# EasyEDA schematic GVM Battery Light.json
TITLE: Sheet_1; REV: 1.0; Date: 2026-01-06; Sheet: 1/1; Company: Your Company
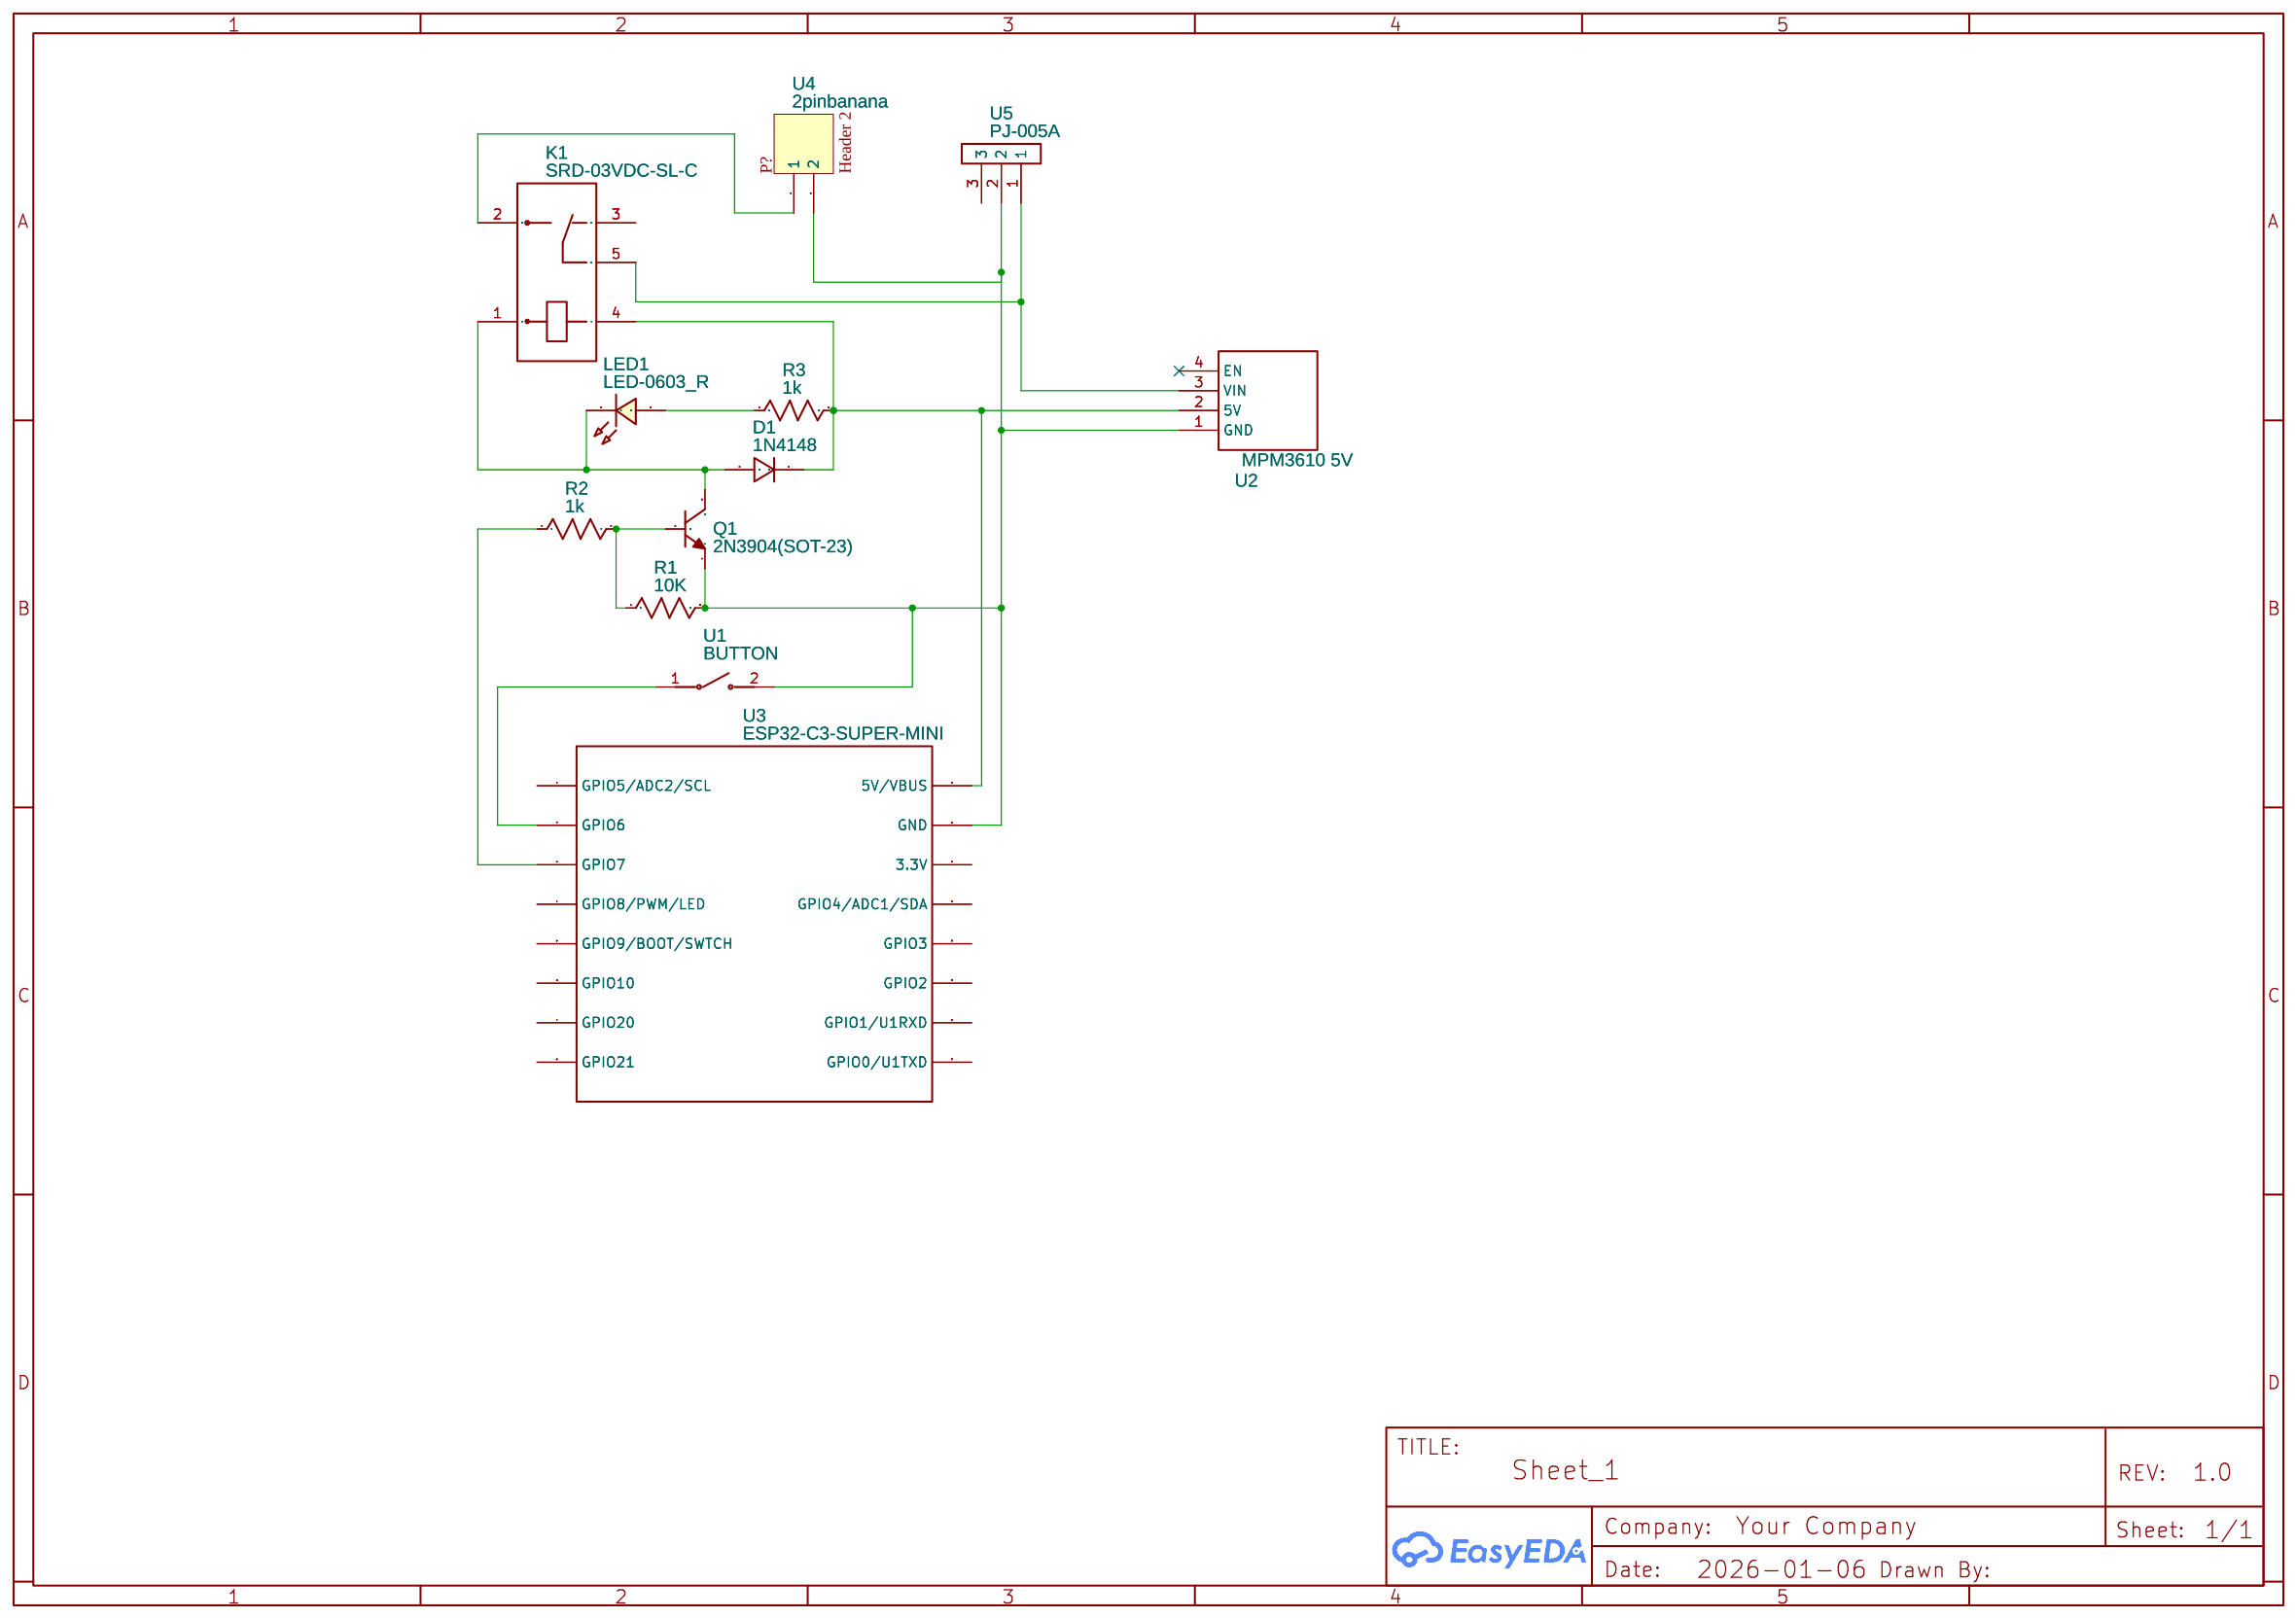
[diagram p0: schematic sheet]

## Parts
D1  1N4148  [DO-35_BD2.0-L4.2-P8.20-D0.5-RD]
K1  SRD-03VDC-SL-C  [RELAY-TH_SRD-XXVDC-XL-C]
LED1  LED-0603_R  [LED0603_RED]
Q1  2N3904(SOT-23)  [SOT-23-3_L2.9-W1.3-P1.90-LS2.4-TR]
R1  10K  [R_AXIAL-0.3]
R2  1k  [R_AXIAL-0.3]
R3  1k  [R_AXIAL-0.3]
U1  BUTTON  [SW-SMD_L3.9-W2.9-LS4.9-L]
U2  MPM3610 5V  [MPM3610]
U3  ESP32-C3-SUPER-MINI  [ESP32-C3-SUPER-MINI]
U4  2pinbanana  [2PINBANANA]
U5  PJ-005A  [PJ-005A]

## Library data of the parts
D1 = 1N4148: Supplier: LCSC; Supplier Part: C13769; Manufacturer: STMicroelectronics; Contributor: LCSC
K1 = SRD-03VDC-SL-C: Supplier: LCSC; Manufacturer: 松乐; Supplier Part: C24585; JLCPCB Part Class: Extended Part
LED1 = LED-0603_R: Manufacturer: EVERLIGHT(台湾亿光); Manufacturer Part: 19-217/R6C-AL1M2VY/3T; Supplier Part: C72044; Supplier: LCSC; Contributor: LCEDA_01
Q1 = 2N3904(SOT-23): Supplier: LCSC; Manufacturer: KEC; Manufacturer Part: 2n3904S-RTK/PS; Supplier Part: C18536; Paste Type: SOT-23; Contributor: LCEDA_Lib
R1-R3 = R_AXIAL-0.3_US: Contributor: LCEDA_Lib
U1 = BUTTON: Contributor: lcsc; Supplier: LCSC; Supplier Part: C9900015607; Manufacturer: null; JLCPCB Part Class: Extended Part
U2 = MPM3610 5V: Manufacturer: Adafruit; link: https://www.adafruit.com/product/4739#description; Contributor: a00838034
U3 = ESP32-C3-SUPER-MINI: Manufacturer: Maker go; link: https://www.tindie.com/products/adz1122/esp32-c3-development-board-esp32-supermini/; Contributor: promocom99
U4 = 2pinbanana: Contributor: nhathaon
U5 = PJ-005A: Contributor: victorketels

## Nets
Net-(D1-1): D1.1 K1.4 R3.2 U2.2(5V) U3.16(5V/VBUS)
Net-(D1-2): D1.2 K1.1 LED1.2 Q1.3(C)
Net-(K1-2): K1.2 U4.1
Net-(K1-5): K1.5 U2.3(VIN) U5.1
Net-(LED1-1): LED1.1 R3.1
Net-(Q1-1): Q1.1(E) R1.2 U1.2 U2.1(GND) U3.15(GND) U4.2 U5.2
Net-(Q1-2): Q1.2(B) R1.1 R2.2
Net-(R2-1): R2.1 U3.3(GPIO7)
Net-(U1-1): U1.1 U3.2(GPIO6)

Not connected (* = marked no-connect by the designer): K1 3; U2 4(EN)*; U3 1(GPIO5/ADC2/SCL) 4(GPIO8/PWM/LED) 5(GPIO9/BOOT/SWTCH) 6(GPIO10) 7(GPIO20) 8(GPIO21) 9(GPIO0/U1TXD) 10(GPIO1/U1RXD) 11(GPIO2) 12(GPIO3) 13(GPIO4/ADC1/SDA) 14(3.3V); U5 3
